# Altium schematic sheet Communications.SchDoc
size A4; SheetNumber: 5; SheetTotal: 5
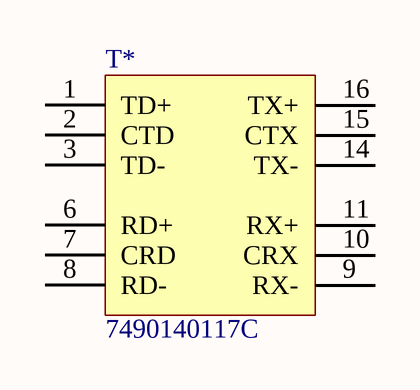
[diagram p0: Communications.SchDoc]

## Parts
T*  7490140117C  [7490140117C]

## Nets

Not connected (* = marked no-connect by the designer): T* 1(TD+) 2(CTD) 3(TD-) 6(RD+) 7(CRD) 8(RD-) 9(RX-) 10(CRX) 11(RX+) 14(TX-) 15(CTX) 16(TX+)

## Library data of the parts
T* = TFMR_7490140117C